# Altium schematic sheet DS134-1.1-B色度传感器.SchDoc
size A4
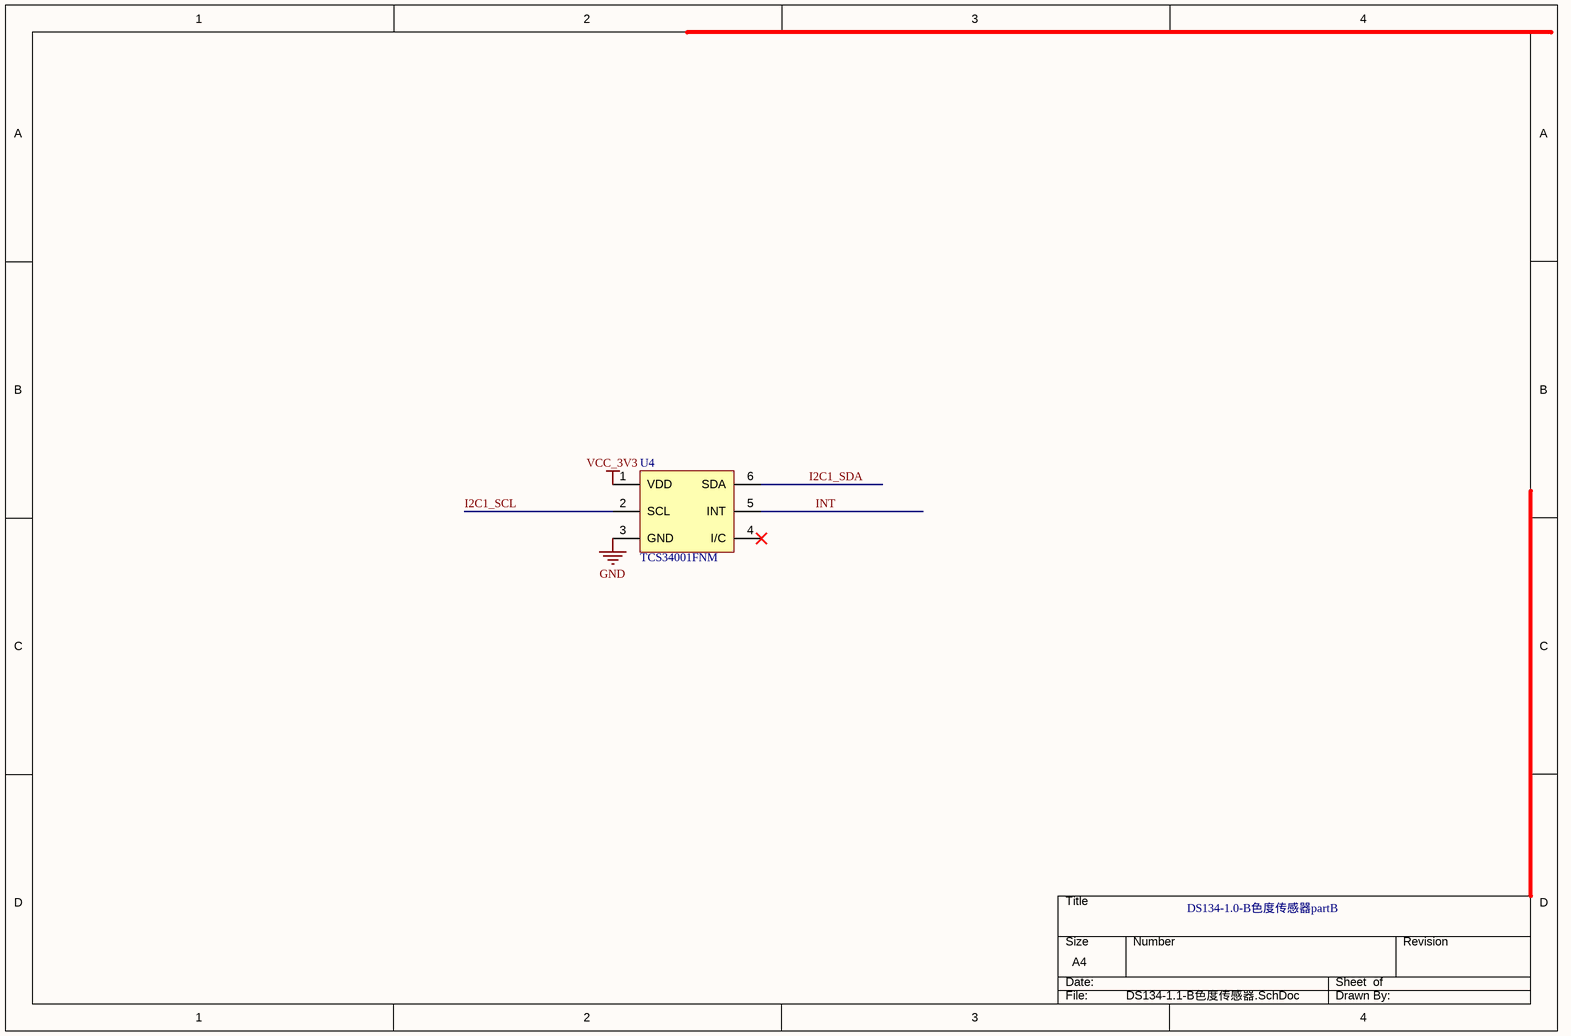
[diagram p0: DS134-1.1-B色度传感器.SchDoc]

## Parts
U4  TCS34001FNM  [DFN-6(2x2.4)]

## Nets
GND: U4.3(GND)
VCC_3V3: U4.1(VDD)
I2C1_SCL: U4.2(SCL)
I2C1_SDA: U4.6(SDA)
INT: U4.5(INT)

Not connected (* = marked no-connect by the designer): U4 4(I/C)*

## Notes on the sheet
- DS134-1.0-B色度传感器partB
- DWG. NO.
- REV.
- SHT.
- THIS DOCUMENT AND THE DATA DISCLOSED HEREIN OR HEREWITH IS THE PROPERTY OF ALTIUM LIMITED AND MAY BE FREELY DISTRIBUTED IN WHOLE. NO RIGHTS ARE RESERVED OR EXPRESS OR IMPLIED WARANTEE GIVEN.
- REVISION
- DESCRIPTION
- DATE
- APPROVED
- ENG:
- APPROVALS
- PROJECT
- DSN:
- CHK:
- REFERENCE DOCUMENTS
- PROJECT REVISION:
- TITLE
- DOCUMENT REVISION:
- DESIGN ITEM:
- BOM:
- FAB DWG:
- PCB DWG:
- ASSY DWG:
- SCALE:
- SIZE
- B
- CAGE CODE
- FILE NAME
- DWG NO.
- SHEET
- OF
- REV

## Library data of the parts
U4 = TCS34001FNM: 环境光传感器